# EAGLE schematic WLS2 (EAGLE 9.6.2)
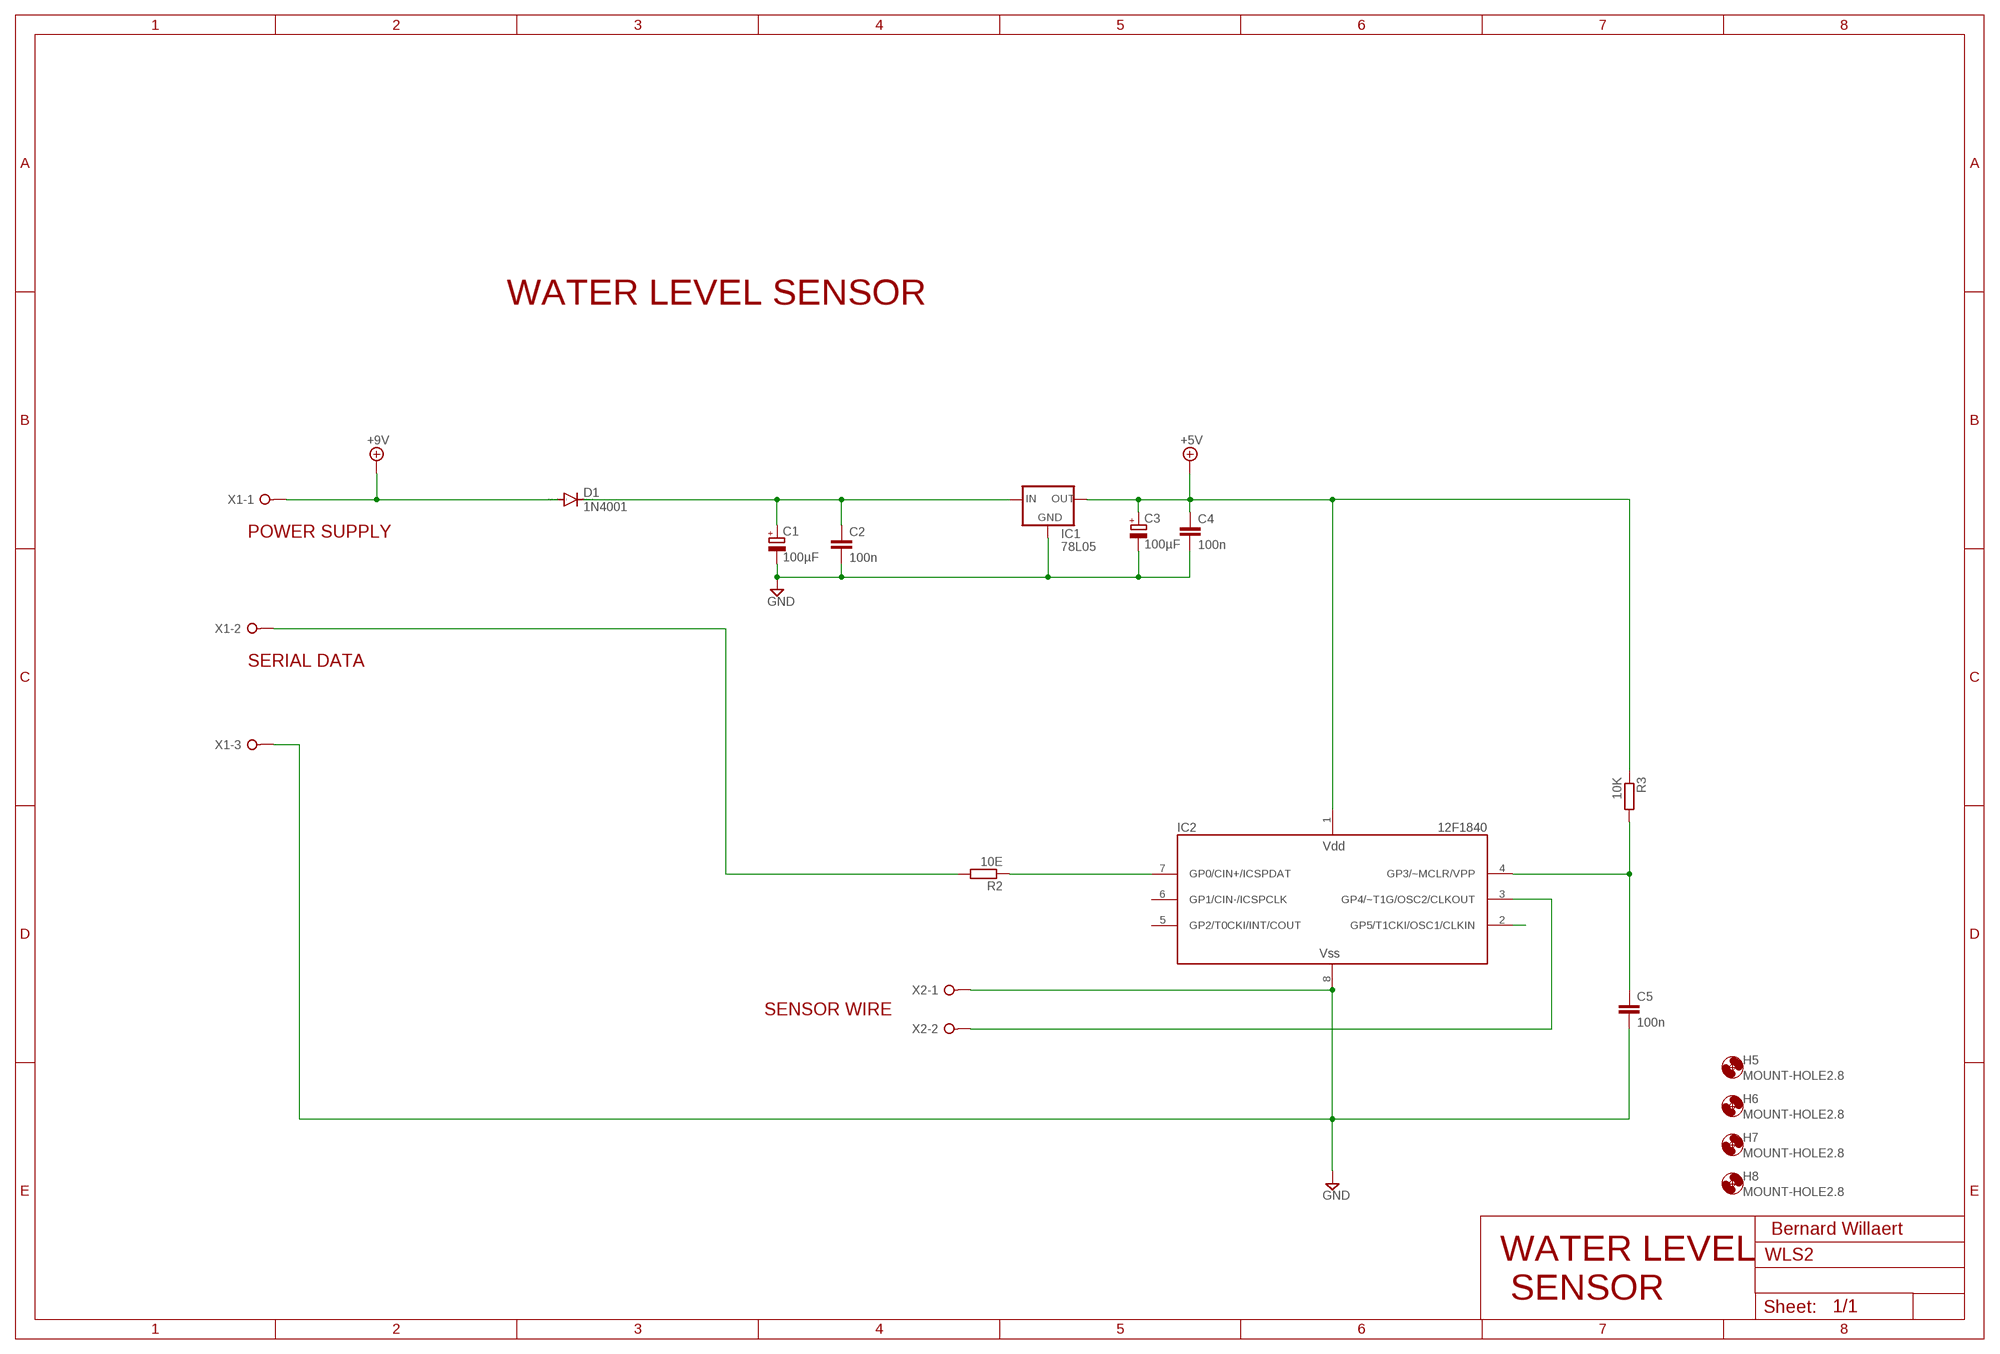
[diagram p0: schematic, sheet 1]

## Parts
C1  100µF  CPOL-EUE5-6  [E5-6]
C2  100n  C-EU050-025X075  [C050-025X075]
C3  100µF  CPOL-EUE5-6  [E5-6]
C4  100n  C-EU050-025X075  [C050-025X075]
C5  100n  C-EU050-025X075  [C050-025X075]
D1  1N4001  1N4004  [DO41-10]
H5  MOUNT-HOLE2.8  [2,8]
H6  MOUNT-HOLE2.8  [2,8]
H7  MOUNT-HOLE2.8  [2,8]
H8  MOUNT-HOLE2.8  [2,8]
IC1  78L05  78LXX  [78LXX]
IC2  12F1840  PIC12F629P  [DIP-8]
R2  10E  R-EU_0207/10  [0207/10]
R3  10K  R-EU_0207/10  [0207/10]
X1  W237-03P  [W237-133]
X2  W237-02P  [W237-132]

## Nets
+5V: C3.+ C4.1 IC1.OUT IC2.1(VDD) R3.1
+9V: D1.A X1.1
GND: C1.- C2.2 C3.- C4.2 C5.2 IC1.GND IC2.8(VSS) X1.3 X2.1
N$1: C5.1 IC2.4(GP3/~MCLR/VPP) R3.2
N$2: R2.2 X1.2
N$3: IC2.3(GP4/~T1G/OSC2/CLKOUT) X2.2
N$4: C1.+ C2.1 D1.C IC1.IN
N$5: IC2.2(GP5/T1CKI/OSC1/CLKIN)
N$22: IC2.7(GP0/CIN+/ICSPDAT) R2.1
Unconnected: IC2.5(GP2/T0CKI/INT/COUT) IC2.6(GP1/CIN-/ICSPCLK)

## Notes on the sheet
- WATER LEVEL SENSOR
- POWER SUPPLY
- SERIAL DATA
- SENSOR WIRE
- Bernard Willaert
- WATER LEVEL
   SENSOR

## Library data of the parts
C1 C3 = rcl:CPOL-EU: POLARIZED CAPACITOR, European symbol
C2 C4 C5 = rcl:C-EU: CAPACITOR, European symbol
D1 = diode:1N4004: DIODE general purpose rectifier, 1 A
H5-H8 = holes:MOUNT-HOLE: MOUNTING HOLE with drill center marker
IC1 = v-reg:78LXX: VOLTAGE REGULATOR
IC2 = microchip2:PIC12F629: Microchip PIC12F629 8-pin 8-bit Flash microcontroller 1024 words program memory, 64 bytes RAM, 128 bytes EEPROM 6 I/O, 1 comparator, 1 8-bit timer, 1 16-bit timer
R2 R3 = rcl:R-EU_: RESISTOR, European symbol
X1 = con-wago-508:W237-03P: WAGO SREW CLAMP; OC_FARNELL: unknown; OC_NEWARK: unknown
X2 = con-wago-508:W237-02P: WAGO SREW CLAMP; OC_FARNELL: unknown; OC_NEWARK: unknown